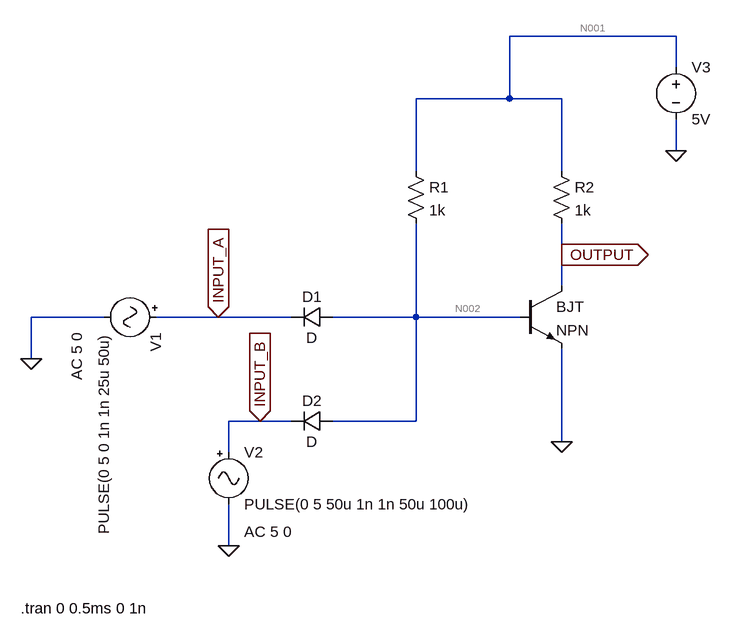
[diagram p0: schematic DTL Circuit.asc]
DTL Circuit.asc, the LTspice schematic file:
Version 4
SHEET 1 880 720
WIRE 464 -208 208 -208
WIRE 464 -160 464 -208
WIRE 208 -112 208 -208
WIRE 208 -112 64 -112
WIRE 288 -112 208 -112
WIRE 464 -32 464 -80
WIRE 64 0 64 -112
WIRE 288 0 288 -112
WIRE 288 128 288 80
WIRE 288 176 288 128
WIRE -416 224 -528 224
WIRE -240 224 -336 224
WIRE -128 224 -240 224
WIRE 64 224 64 80
WIRE 64 224 -64 224
WIRE 224 224 64 224
WIRE -528 288 -528 224
WIRE -176 384 -224 384
WIRE -128 384 -176 384
WIRE 64 384 64 224
WIRE 64 384 -64 384
WIRE 288 416 288 272
WIRE -224 432 -224 384
WIRE -224 576 -224 512
FLAG 288 416 0
FLAG -528 288 0
FLAG -224 576 0
FLAG 464 -32 0
FLAG 288 128 OUTPUT
IOPIN 288 128 Out
FLAG -240 224 INPUT_A
IOPIN -240 224 In
FLAG -176 384 INPUT_B
IOPIN -176 384 In
SYMBOL npn 224 176 R0
SYMATTR InstName BJT
SYMBOL res 48 -16 R0
SYMATTR InstName R1
SYMATTR Value 1k
SYMBOL res 272 -16 R0
SYMATTR InstName R2
SYMATTR Value 1k
SYMBOL diode -64 208 R90
WINDOW 0 0 32 VBottom 2
WINDOW 3 32 32 VTop 2
SYMATTR InstName D1
SYMBOL diode -64 368 R90
WINDOW 0 0 32 VBottom 2
WINDOW 3 32 32 VTop 2
SYMATTR InstName D2
SYMBOL Misc\\signal -320 224 R90
WINDOW 123 24 138 Left 2
WINDOW 39 0 0 Left 0
SYMATTR Value2 AC 5 0
SYMATTR InstName V1
SYMATTR Value PULSE(0 5 0 1n 1n 25u 50u)
SYMBOL Misc\\signal -224 416 R0
WINDOW 123 24 138 Left 2
WINDOW 39 0 0 Left 0
SYMATTR Value2 AC 5 0
SYMATTR InstName V2
SYMATTR Value PULSE(0 5 50u 1n 1n 50u 100u)
SYMBOL voltage 464 -176 R0
WINDOW 123 0 0 Left 0
WINDOW 39 0 0 Left 0
SYMATTR InstName V3
SYMATTR Value 5V
TEXT -544 672 Left 2 !.tran 0 0.5ms 0 1n

The netlist it stands for:
* DTL Circuit.asc
Q§BJT OUTPUT N002 0 0 NPN
R1 N001 N002 1k
R2 N001 OUTPUT 1k
D1 N002 INPUT_A D
D2 N002 INPUT_B D
V1 INPUT_A 0 PULSE(0 5 0 1n 1n 25u 50u) AC 5 0
V2 INPUT_B 0 PULSE(0 5 50u 1n 1n 50u 100u) AC 5 0
V3 N001 0 5V
.model D D
.lib standard.dio
.model NPN NPN
.model PNP PNP
.lib standard.bjt
.tran 0 0.5ms 0 1n
.backanno
.end

* Results of the author's LTspice run, read from the files saved beside the schematic
* Operating Point, zero values left out:
*   V(output) = 4.978 V
*   V(n002) = 675.1 mV
*   V(n001) = 5 V
*   Ic(Bjt) = 21.62 µA
*   Ib(Bjt) = 216.2 nA
*   Ie(Bjt) = -21.84 µA
*   I(D1) = 2.162 mA
*   I(D2) = 2.162 mA
*   I(R1) = 4.325 mA
*   I(R2) = 21.62 µA
*   I(V1) = 2.162 mA
*   I(V2) = 2.162 mA
*   I(V3) = -4.347 mA
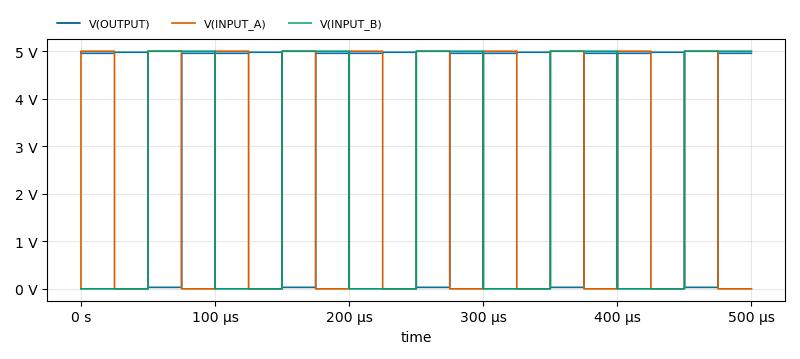
[diagram p1: Transient Analysis of DTL Circuit.asc, plotted from the saved traces]
* Transient Analysis, 1 run:
*   V(OUTPUT): min 30.35 mV, max 4.978 V, average 3.73 V, rms 4.299 V, last 4.957 V
*   V(INPUT_A): min 0 V, max 5 V, average 2.5 V, rms 3.536 V, last 0 V
*   V(INPUT_B): min 0 V, max 5 V, average 2.5 V, rms 3.536 V, last 5 V